# Altium schematic sheet solar plant watering alarm.SchDoc
size A; SheetNumber: 1; SheetTotal: 1
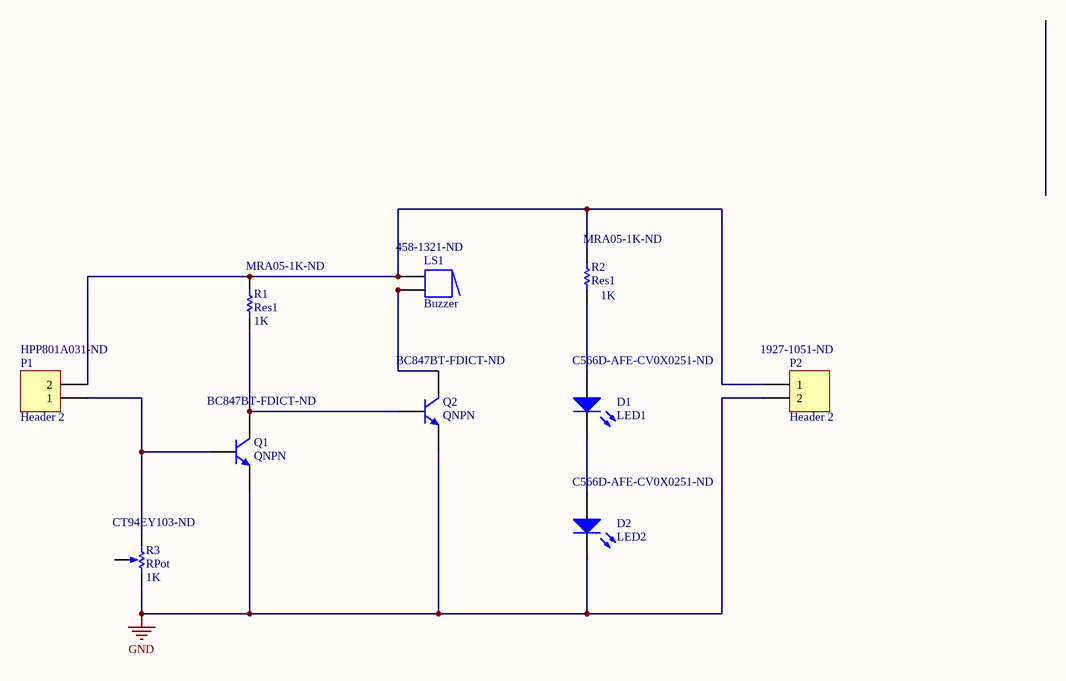
[diagram p0: solar plant watering alarm.SchDoc]

## Parts
D1  LED1  Supplier Part Number 1: C566D-AFE-CV0X0251-ND  [LED-1]
D2  LED2  Supplier Part Number 1: C566D-AFE-CV0X0251-ND  [LED-1]
LS1  Buzzer  Supplier Part Number 1: 458-1321-ND  [ABSM-1574]
P1  Header 2  Supplier Part Number 1: HPP801A031-ND  [HDR1X2]
P2  Header 2  Supplier Part Number 1: 1927-1051-ND  [HDR1X2]
Q1  QNPN  Supplier Part Number 1: BC847BT-FDICT-ND  [SOT-23B_N]
Q2  QNPN  Supplier Part Number 1: BC847BT-FDICT-ND  [SOT-23B_N]
R1  Res1  value 1K  Supplier Part Number 1: MRA05-1K-ND  [AXIAL-0.3]
R2  Res1  value 1K  Supplier Part Number 1: MRA05-1K-ND  [AXIAL-0.3]
R3  RPot  value 1K  Supplier Part Number 1: CT94EY103-ND  [VR5]

## Nets
GND: D2.2(K) P2.2 Q1.3(E) Q2.3(E) R3.2(BOT)
NetD1_1: D1.1(A) R2.1
NetD1_2: D1.2(K) D2.1(A)
NetLS1_1: LS1.1 LS1.1A P1.2 P2.1 R1.2 R2.2
NetLS1_2: LS1.2 LS1.2A Q2.1(C)
NetP1_1: P1.1 Q1.2(B) R3.1(TOP)
NetQ1_1: Q1.1(C) Q2.2(B) R1.1

Not connected (* = marked no-connect by the designer): R3 3(TAP)

## Library data of the parts
D1 D2 = LED1: Typical RED GaAs LED; Published: 8-Jun-2000; LatestRevisionDate: 08-Jul-2005; LatestRevisionNote: Mech Layer 1 removed.; PackageReference: LED-1; Publisher: Altium Limited; PackageDescription: LED; 2 Leads; Supplier 1: Digi-Key
LS1 = Buzzer: Magnetic Transducer Buzzer; Published: 24-Mar-1999; LatestRevisionDate: 17-Dec-2003; LatestRevisionNote: Schematic revised, PCB Footprint replaced.; DatasheetVersion: 17-Dec-2003; PackageReference: ABSM-1574; Publisher: Altium Limited; PackageDescription: Magnetic Transducer Buzzer; ComponentLink1Description: Manufacturer Link; ComponentLink1URL: http://www.megastar.com/linecard/buzzmode/index.php; Supplier 1: Digi-Key
P1 P2 = Header 2: Header, 2-Pin; LatestRevisionDate: 17-Jul-2002; LatestRevisionNote: Re-released for DXP Platform.; Publisher: Altium Limited; Supplier 1: Digi-Key
Q1 Q2 = QNPN: NPN Bipolar Transistor; Published: 8-Jun-2000; LatestRevisionDate: 29-May-2009; LatestRevisionNote: IPC-7351 Footprint Added.; PackageVersion: Aug-1999; PackageReference: SOT-23B; Publisher: Altium Limited; PackageDescription: 3-Pin SOT-23 Package 0.95 mm Pitch, 2.4 mm Lead Span; Supplier 1: Digi-Key
R1 R2 = Res1: Resistor; Published: 8-Jun-2000; LatestRevisionDate: 17-Jul-2002; LatestRevisionNote: Re-released for DXP Platform.; PackageReference: AXIAL-0.3; Publisher: Altium Limited; PackageDescription: Axial Device, Thru-Hole; 2 Leads; 0.3 in Pin Spacing; Supplier 1: Digi-Key
R3 = RPot: Potentiometer; Sim Note: Enter the Resistance value and the set point into parameter fields.; Set Position: 0.5; Published: 8-Jun-2000; LatestRevisionDate: 17-Jul-2002; LatestRevisionNote: Re-released for DXP Platform.; PackageReference: VR5; Publisher: Altium Limited; PackageDescription: Variable Resistor, Thru-Hole; 3 Leads; Supplier 1: Digi-Key